# EAGLE schematic soundpuddle_megawing_mk1 (EAGLE 6.2)
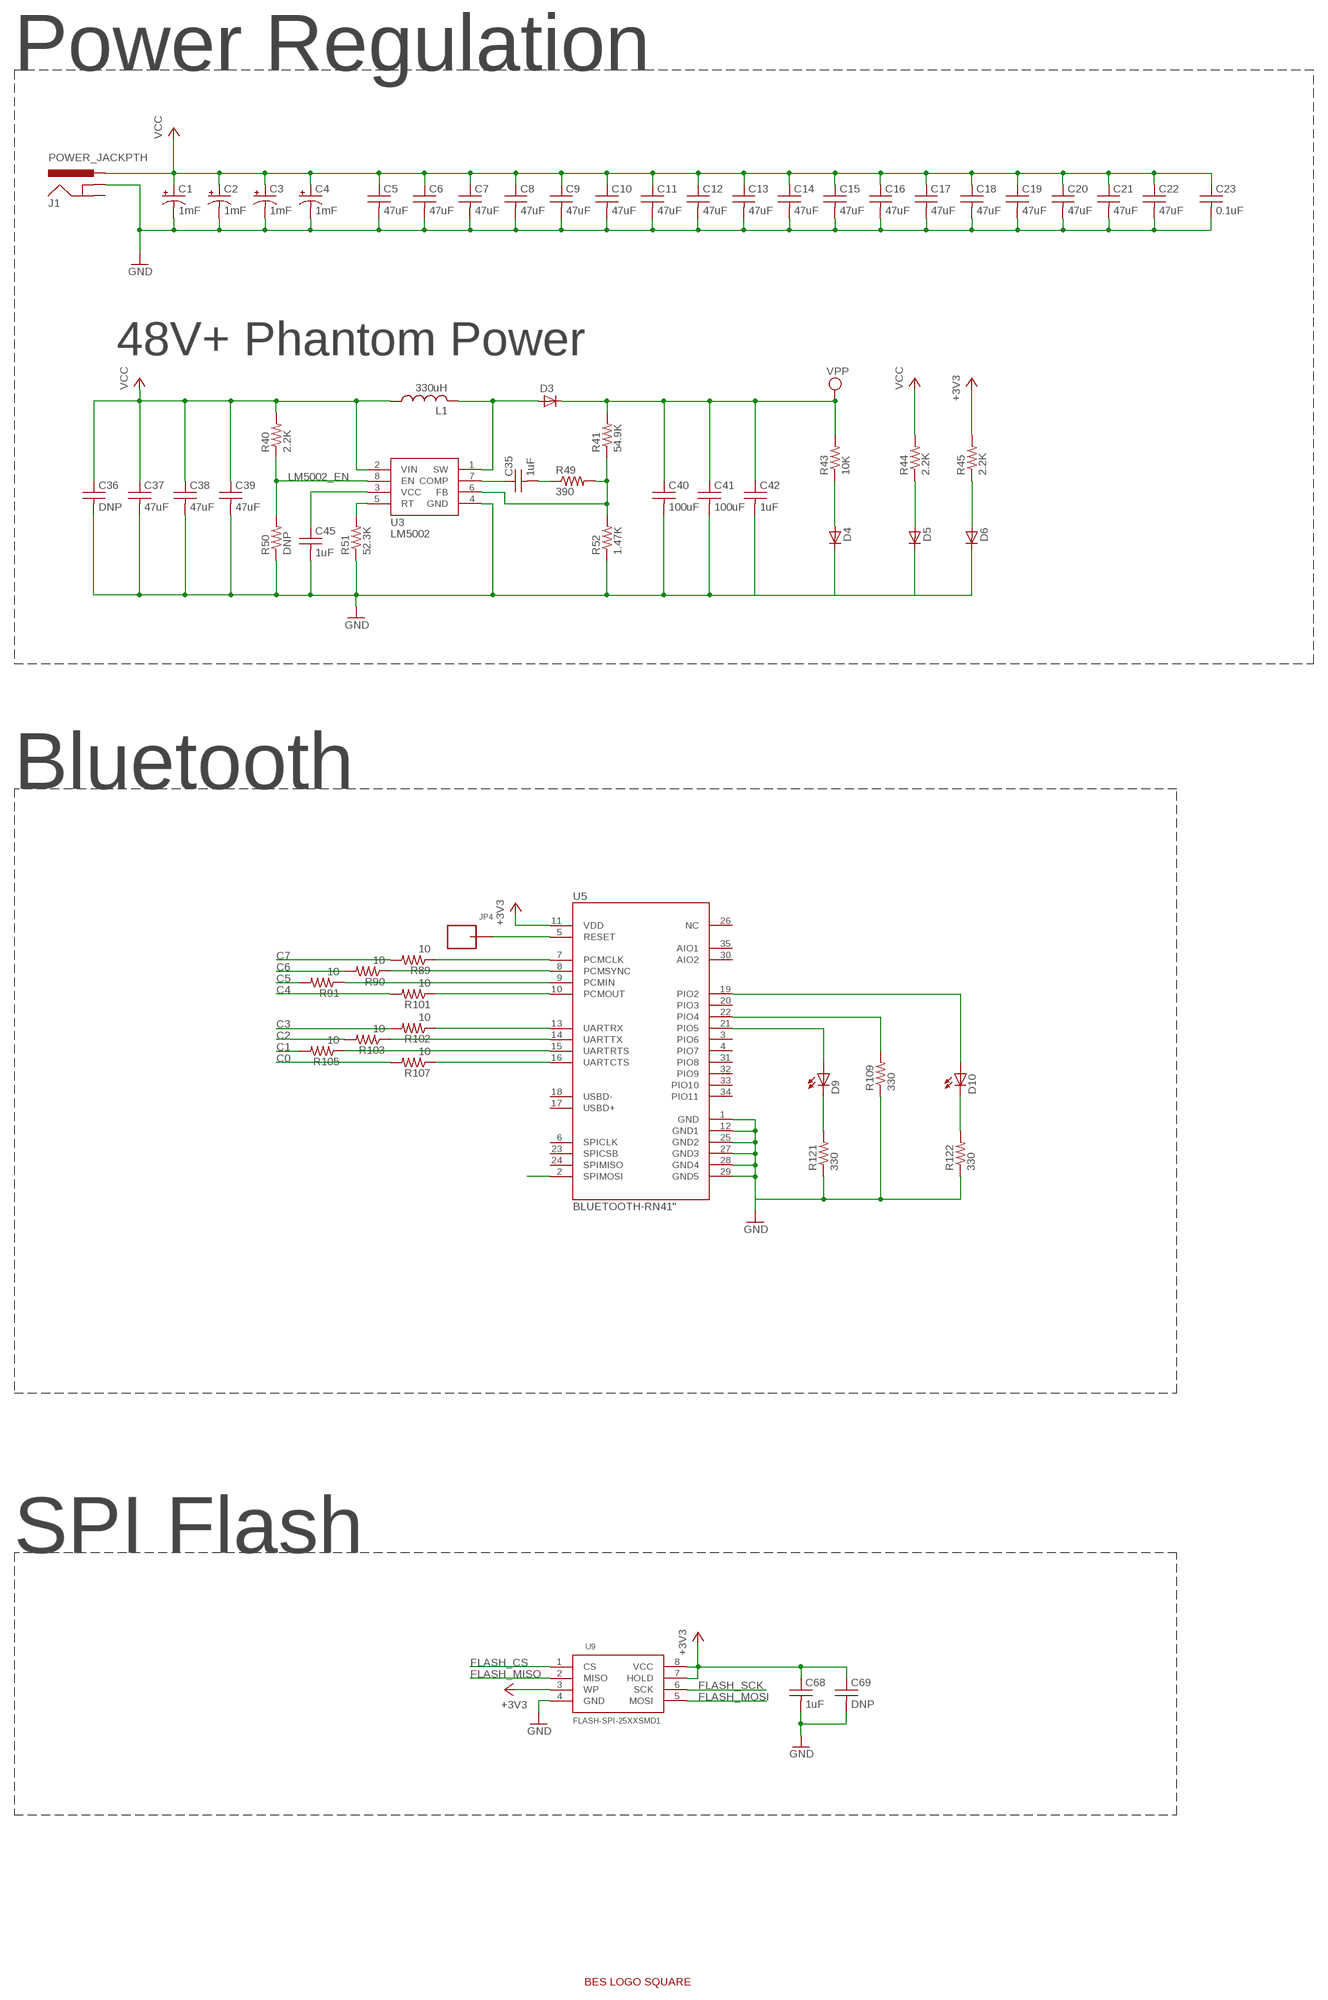
[diagram p0: schematic, sheet 1, part 1 of 3]
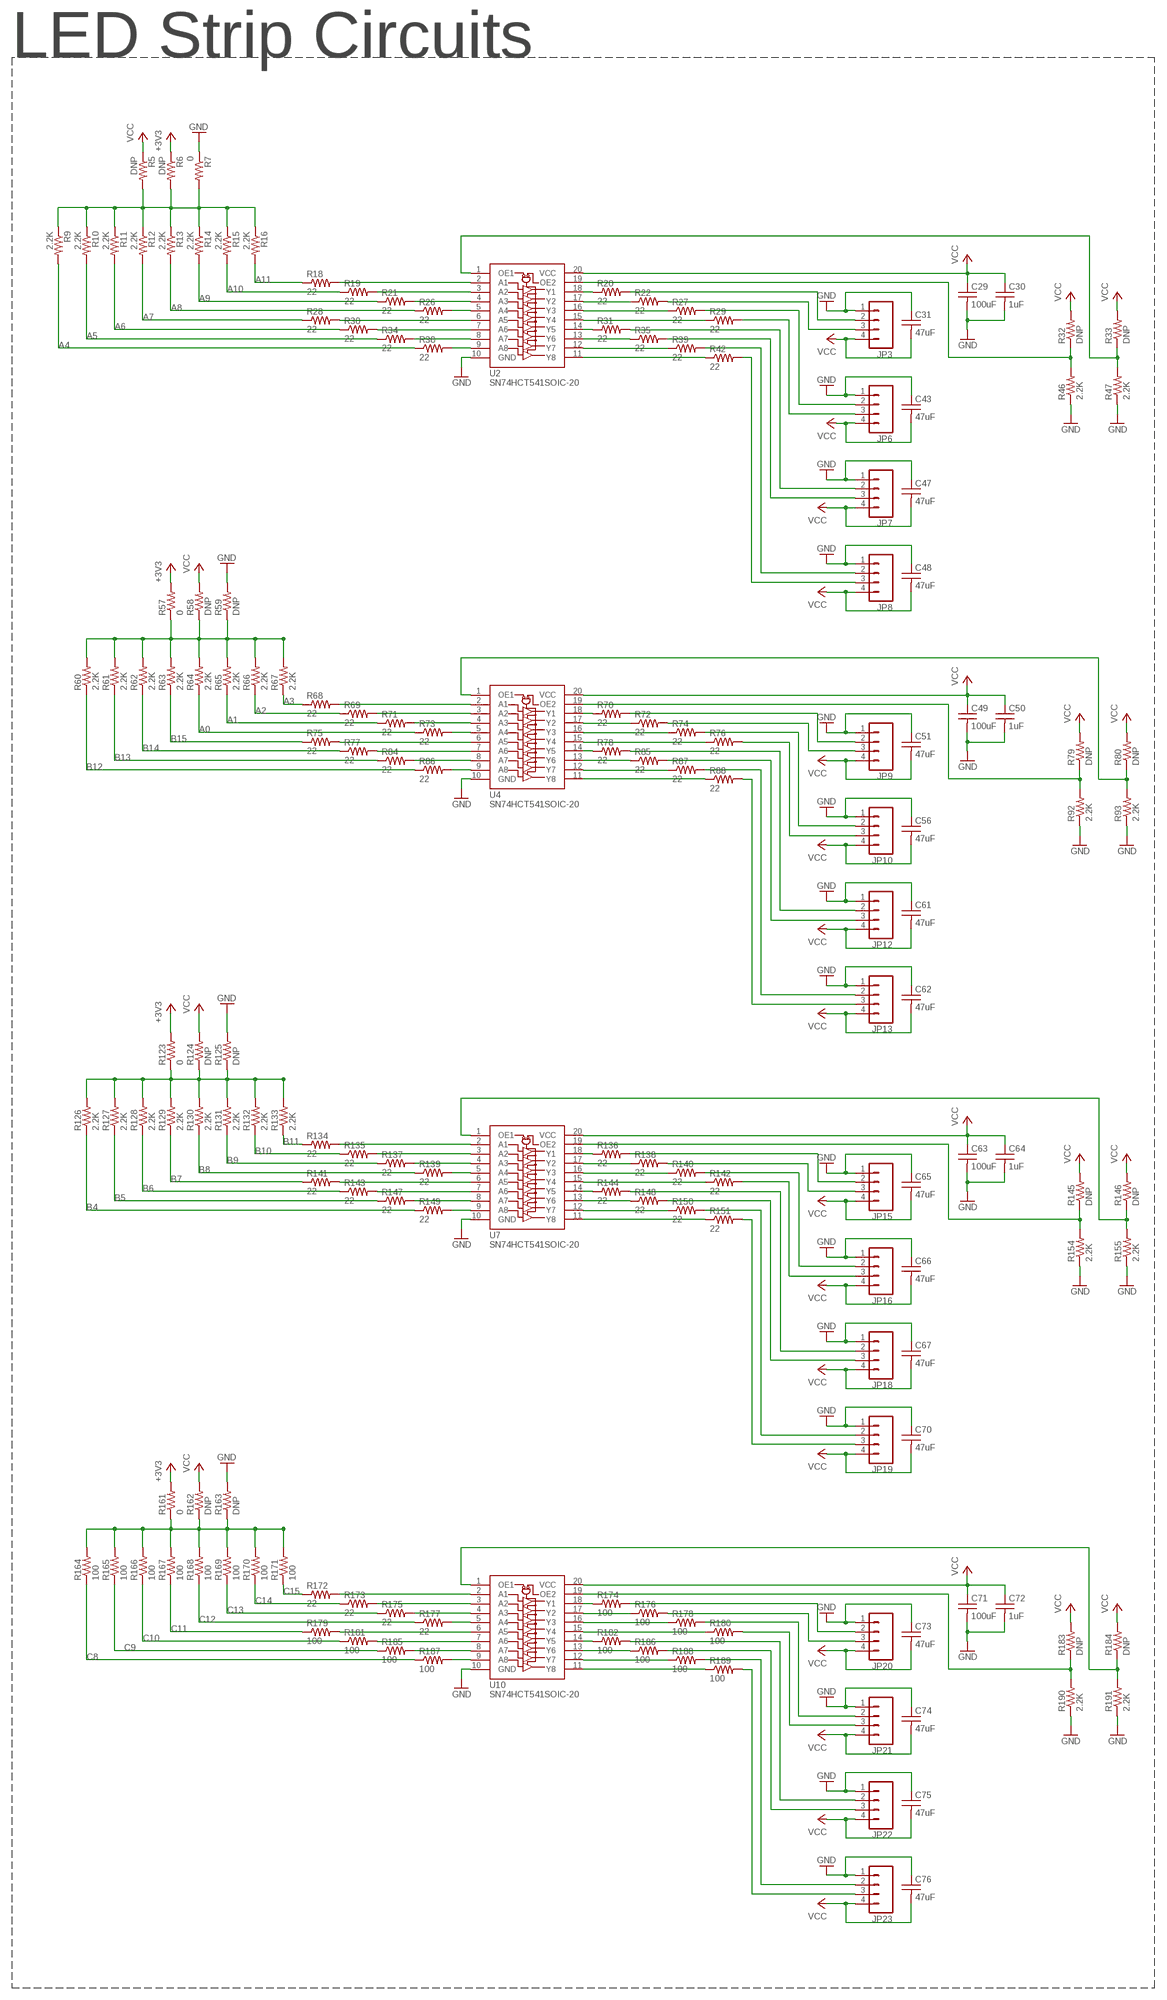
[diagram p1: schematic, sheet 1, part 2 of 3]
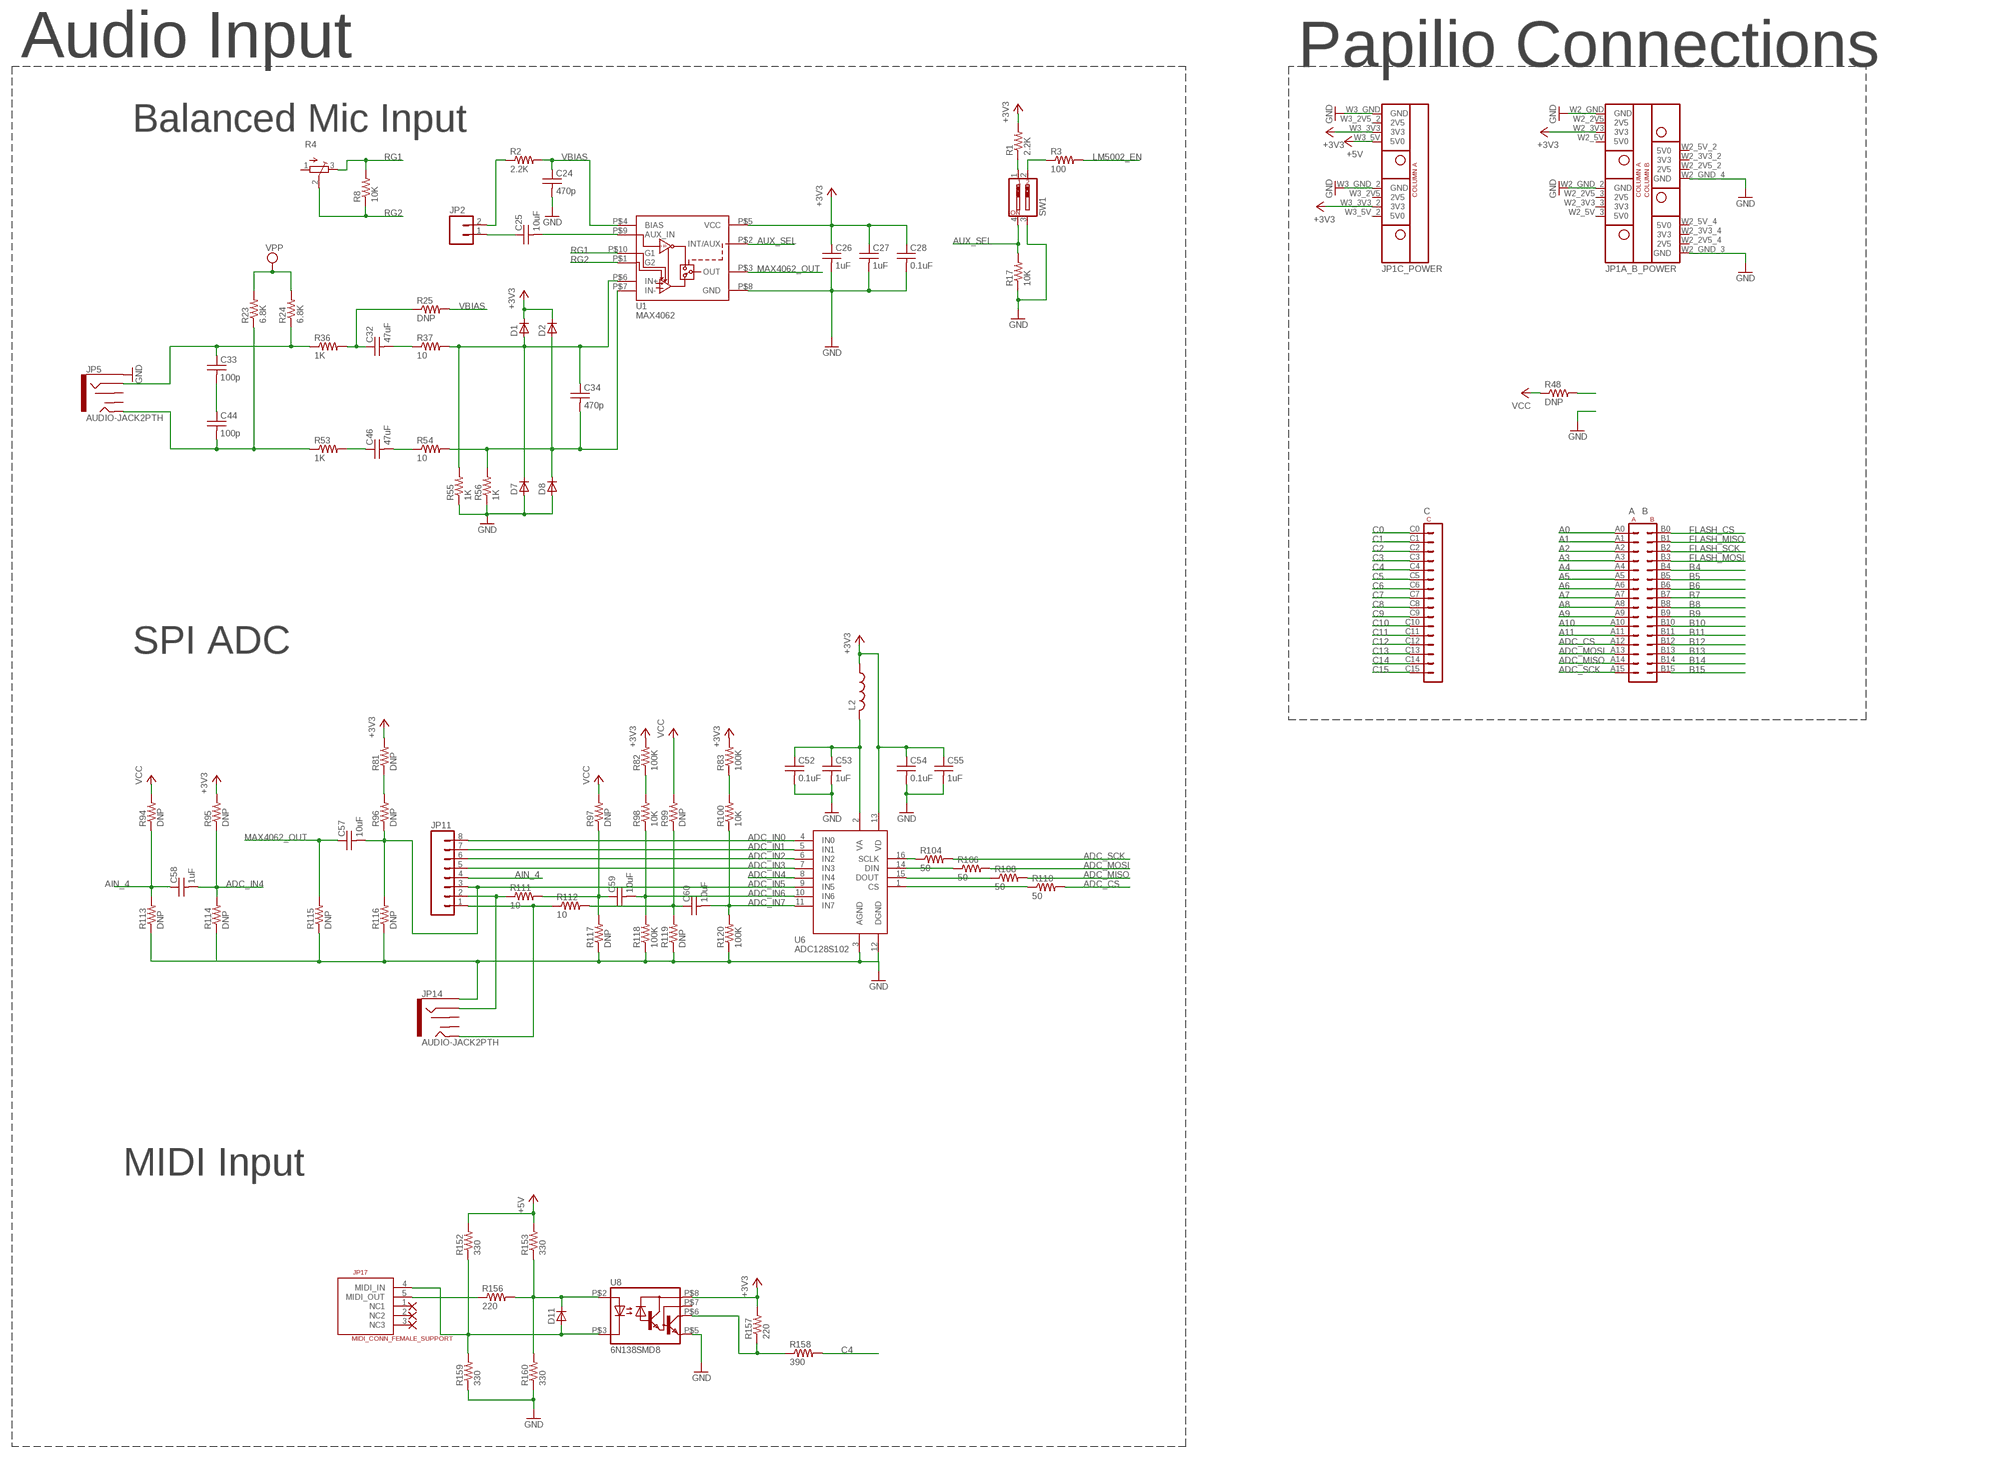
[diagram p2: schematic, sheet 1, part 3 of 3]

## Parts
C1  1mF  CPOL-USE5-8.5  [E5-8,5]
C2  1mF  CPOL-USE5-8.5  [E5-8,5]
C3  1mF  CPOL-USE5-8.5  [E5-8,5]
C4  1mF  CPOL-USE5-8.5  [E5-8,5]
C5  47uF  CAPACITORC_1206  [1206]
C6  47uF  CAPACITORC_1206  [1206]
C7  47uF  CAPACITORC_1206  [1206]
C8  47uF  CAPACITORC_1206  [1206]
C9  47uF  CAPACITORC_1206  [1206]
C10  47uF  CAPACITORC_1206  [1206]
C11  47uF  CAPACITORC_1206  [1206]
C12  47uF  CAPACITORC_1206  [1206]
C13  47uF  CAPACITORC_1206  [1206]
C14  47uF  CAPACITORC_1206  [1206]
C15  47uF  CAPACITORC_1206  [1206]
C16  47uF  CAPACITORC_1206  [1206]
C17  47uF  CAPACITORC_1206  [1206]
C18  47uF  CAPACITORC_1206  [1206]
C19  47uF  CAPACITORC_1206  [1206]
C20  47uF  CAPACITORC_1206  [1206]
C21  47uF  CAPACITORC_1206  [1206]
C22  47uF  CAPACITORC_1206  [1206]
C23  0.1uF  CAPACITORC_0603  [0603]
C24  470p  CAPACITORC_0603  [0603]
C25  10uF  CAPACITORC_0603  [0603]
C26  1uF  CAPACITORC_0603  [0603]
C27  1uF  CAPACITORC_0603  [0603]
C28  0.1uF  CAPACITORC_0603  [0603]
C29  100uF  CAPACITORC_1206  [1206]
C30  1uF  CAPACITORC_0603  [0603]
C31  47uF  CAPACITORC_1206  [1206]
C32  47uF  CAPACITORC_1206  [1206]
C33  100p  CAPACITORC_0603  [0603]
C34  470p  CAPACITORC_0603  [0603]
C35  1uF  CAPACITORC_0603  [0603]
C36  DNP  CAPACITORC_0603  [0603]
C37  47uF  CAPACITORC_1206  [1206]
C38  47uF  CAPACITORC_1206  [1206]
C39  47uF  CAPACITORC_1206  [1206]
C40  100uF  CAPACITORC_1206  [1206]
C41  100uF  CAPACITORC_1206  [1206]
C42  1uF  CAPACITORC_0603  [0603]
C43  47uF  CAPACITORC_1206  [1206]
C44  100p  CAPACITORC_0603  [0603]
C45  1uF  CAPACITORC_0603  [0603]
C46  47uF  CAPACITORC_1206  [1206]
C47  47uF  CAPACITORC_1206  [1206]
C48  47uF  CAPACITORC_1206  [1206]
C49  100uF  CAPACITORC_1206  [1206]
C50  1uF  CAPACITORC_0603  [0603]
C51  47uF  CAPACITORC_1206  [1206]
C52  0.1uF  CAPACITORC_0603  [0603]
C53  1uF  CAPACITORC_0603  [0603]
C54  0.1uF  CAPACITORC_0603  [0603]
C55  1uF  CAPACITORC_0603  [0603]
C56  47uF  CAPACITORC_1206  [1206]
C57  10uF  CAPACITORC_0603  [0603]
C58  1uF  CAPACITORC_0603  [0603]
C59  10uF  CAPACITORC_0603  [0603]
C60  10uF  CAPACITORC_0603  [0603]
C61  47uF  CAPACITORC_1206  [1206]
C62  47uF  CAPACITORC_1206  [1206]
C63  100uF  CAPACITORC_1206  [1206]
C64  1uF  CAPACITORC_0603  [0603]
C65  47uF  CAPACITORC_1206  [1206]
C66  47uF  CAPACITORC_1206  [1206]
C67  47uF  CAPACITORC_1206  [1206]
C68  1uF  CAPACITORC_0603  [0603]
C69  DNP  CAPACITORC_1206  [1206]
C70  47uF  CAPACITORC_1206  [1206]
C71  100uF  CAPACITORC_1206  [1206]
C72  1uF  CAPACITORC_0603  [0603]
C73  47uF  CAPACITORC_1206  [1206]
C74  47uF  CAPACITORC_1206  [1206]
C75  47uF  CAPACITORC_1206  [1206]
C76  47uF  CAPACITORC_1206  [1206]
D1  DIODE_SMDSOD-323  [SOD-323]
D2  DIODE_SMDSOD-323  [SOD-323]
D3  DIODE_SMDSOD-323  [SOD-323]
D4  DIODE_SMDSOD-323  [SOD-323]
D5  DIODE_SMDSOD-323  [SOD-323]
D6  DIODE_SMDSOD-323  [SOD-323]
D7  DIODE_SMDSOD-323  [SOD-323]
D8  DIODE_SMDSOD-323  [SOD-323]
D9  LED0805  [LED_0805]
D10  LED0805  [LED_0805]
D11  DIODE_SMDSOD-323  [SOD-323]
J1  POWER_JACKPTH  [POWER_JACK_PTH]
JP1  PAPILIO_PLUS_MEGAWING  [PAPILIO_PLUS]
JP2  M02PTH  [1X02]
JP3  M04POLAR  [MOLEX-1X4]
JP4  HEADER-SMALL-1PIN  [HEADER-SMALL-1PIN-0.036IN]
JP5  AUDIO-JACK2PTH  [AUDIO-JACK]
JP6  M04POLAR  [MOLEX-1X4]
JP7  M04POLAR  [MOLEX-1X4]
JP8  M04POLAR  [MOLEX-1X4]
JP9  M04POLAR  [MOLEX-1X4]
JP10  M04POLAR  [MOLEX-1X4]
JP11  M081X08  [1X08]
JP12  M04POLAR  [MOLEX-1X4]
JP13  M04POLAR  [MOLEX-1X4]
JP14  AUDIO-JACK2PTH  [AUDIO-JACK]
JP15  M04POLAR  [MOLEX-1X4]
JP16  M04POLAR  [MOLEX-1X4]
JP17  MIDI_CONN_FEMALE_SUPPORT  [DIN_5_FEMALE_SUPPORT]
JP18  M04POLAR  [MOLEX-1X4]
JP19  M04POLAR  [MOLEX-1X4]
JP20  M04POLAR  [MOLEX-1X4]
JP21  M04POLAR  [MOLEX-1X4]
JP22  M04POLAR  [MOLEX-1X4]
JP23  M04POLAR  [MOLEX-1X4]
L1  330uH  INDUCTOR10X10MM  [INDUCTOR_10X10MM]
L2  INDUCTOR0603  [0603]
LOGO1  LOGO  [LOGO]
R1  2.2K  RESISTORR_0603  [0603]
R2  2.2K  RESISTORR_0603  [0603]
R3  100  RESISTORR_0603  [0603]
R4  TRIMPOTTC33X  [TC33X]
R5  DNP  RESISTORR_0603  [0603]
R6  DNP  RESISTORR_0603  [0603]
R7  0  RESISTORR_0603  [0603]
R8  10K  RESISTORR_0603  [0603]
R9  2.2K  RESISTORR_0603  [0603]
R10  2.2K  RESISTORR_0603  [0603]
R11  2.2K  RESISTORR_0603  [0603]
R12  2.2K  RESISTORR_0603  [0603]
R13  2.2K  RESISTORR_0603  [0603]
R14  2.2K  RESISTORR_0603  [0603]
R15  2.2K  RESISTORR_0603  [0603]
R16  2.2K  RESISTORR_0603  [0603]
R17  10K  RESISTORR_0603  [0603]
R18  22  RESISTORR_0603  [0603]
R19  22  RESISTORR_0603  [0603]
R20  22  RESISTORR_0603  [0603]
R21  22  RESISTORR_0603  [0603]
R22  22  RESISTORR_0603  [0603]
R23  6.8K  RESISTORR_0603  [0603]
R24  6.8K  RESISTORR_0603  [0603]
R25  DNP  RESISTORR_0603  [0603]
R26  22  RESISTORR_0603  [0603]
R27  22  RESISTORR_0603  [0603]
R28  22  RESISTORR_0603  [0603]
R29  22  RESISTORR_0603  [0603]
R30  22  RESISTORR_0603  [0603]
R31  22  RESISTORR_0603  [0603]
R32  DNP  RESISTORR_0603  [0603]
R33  DNP  RESISTORR_0603  [0603]
R34  22  RESISTORR_0603  [0603]
R35  22  RESISTORR_0603  [0603]
R36  1K  RESISTORR_0603  [0603]
R37  10  RESISTORR_0603  [0603]
R38  22  RESISTORR_0603  [0603]
R39  22  RESISTORR_0603  [0603]
R40  2.2K  RESISTORR_0603  [0603]
R41  54.9K  RESISTORR_0603  [0603]
R42  22  RESISTORR_0603  [0603]
R43  10K  RESISTORR_0603  [0603]
R44  2.2K  RESISTORR_0603  [0603]
R45  2.2K  RESISTORR_0603  [0603]
R46  2.2K  RESISTORR_0603  [0603]
R47  2.2K  RESISTORR_0603  [0603]
R48  DNP  RESISTORR_0603  [0603]
R49  390  RESISTORR_0603  [0603]
R50  DNP  RESISTORR_0603  [0603]
R51  52.3K  RESISTORR_0603  [0603]
R52  1.47K  RESISTORR_0603  [0603]
R53  1K  RESISTORR_0603  [0603]
R54  10  RESISTORR_0603  [0603]
R55  1K  RESISTORR_0603  [0603]
R56  1K  RESISTORR_0603  [0603]
R57  0  RESISTORR_0603  [0603]
R58  DNP  RESISTORR_0603  [0603]
R59  DNP  RESISTORR_0603  [0603]
R60  2.2K  RESISTORR_0603  [0603]
R61  2.2K  RESISTORR_0603  [0603]
R62  2.2K  RESISTORR_0603  [0603]
R63  2.2K  RESISTORR_0603  [0603]
R64  2.2K  RESISTORR_0603  [0603]
R65  2.2K  RESISTORR_0603  [0603]
R66  2.2K  RESISTORR_0603  [0603]
R67  2.2K  RESISTORR_0603  [0603]
R68  22  RESISTORR_0603  [0603]
R69  22  RESISTORR_0603  [0603]
R70  22  RESISTORR_0603  [0603]
R71  22  RESISTORR_0603  [0603]
R72  22  RESISTORR_0603  [0603]
R73  22  RESISTORR_0603  [0603]
R74  22  RESISTORR_0603  [0603]
R75  22  RESISTORR_0603  [0603]
R76  22  RESISTORR_0603  [0603]
R77  22  RESISTORR_0603  [0603]
R78  22  RESISTORR_0603  [0603]
R79  DNP  RESISTORR_0603  [0603]
R80  DNP  RESISTORR_0603  [0603]
R81  DNP  RESISTORR_0603  [0603]
R82  100K  RESISTORR_0603  [0603]
R83  100K  RESISTORR_0603  [0603]
R84  22  RESISTORR_0603  [0603]
R85  22  RESISTORR_0603  [0603]
R86  22  RESISTORR_0603  [0603]
R87  22  RESISTORR_0603  [0603]
R88  22  RESISTORR_0603  [0603]
R89  10  RESISTORR_0603  [0603]
R90  10  RESISTORR_0603  [0603]
R91  10  RESISTORR_0603  [0603]
R92  2.2K  RESISTORR_0603  [0603]
R93  2.2K  RESISTORR_0603  [0603]
R94  DNP  RESISTORR_0603  [0603]
R95  DNP  RESISTORR_0603  [0603]
R96  DNP  RESISTORR_0603  [0603]
R97  DNP  RESISTORR_0603  [0603]
R98  10K  RESISTORR_0603  [0603]
R99  DNP  RESISTORR_0603  [0603]
R100  10K  RESISTORR_0603  [0603]
R101  10  RESISTORR_0603  [0603]
R102  10  RESISTORR_0603  [0603]
R103  10  RESISTORR_0603  [0603]
R104  50  RESISTORR_0603  [0603]
R105  10  RESISTORR_0603  [0603]
R106  50  RESISTORR_0603  [0603]
R107  10  RESISTORR_0603  [0603]
R108  50  RESISTORR_0603  [0603]
R109  330  RESISTORR_0603  [0603]
R110  50  RESISTORR_0603  [0603]
R111  10  RESISTORR_0603  [0603]
R112  10  RESISTORR_0603  [0603]
R113  DNP  RESISTORR_0603  [0603]
R114  DNP  RESISTORR_0603  [0603]
R115  DNP  RESISTORR_0603  [0603]
R116  DNP  RESISTORR_0603  [0603]
R117  DNP  RESISTORR_0603  [0603]
R118  100K  RESISTORR_0603  [0603]
R119  DNP  RESISTORR_0603  [0603]
R120  100K  RESISTORR_0603  [0603]
R121  330  RESISTORR_0603  [0603]
R122  330  RESISTORR_0603  [0603]
R123  0  RESISTORR_0603  [0603]
R124  DNP  RESISTORR_0603  [0603]
R125  DNP  RESISTORR_0603  [0603]
R126  2.2K  RESISTORR_0603  [0603]
R127  2.2K  RESISTORR_0603  [0603]
R128  2.2K  RESISTORR_0603  [0603]
R129  2.2K  RESISTORR_0603  [0603]
R130  2.2K  RESISTORR_0603  [0603]
R131  2.2K  RESISTORR_0603  [0603]
R132  2.2K  RESISTORR_0603  [0603]
R133  2.2K  RESISTORR_0603  [0603]
R134  22  RESISTORR_0603  [0603]
R135  22  RESISTORR_0603  [0603]
R136  22  RESISTORR_0603  [0603]
R137  22  RESISTORR_0603  [0603]
R138  22  RESISTORR_0603  [0603]
R139  22  RESISTORR_0603  [0603]
R140  22  RESISTORR_0603  [0603]
R141  22  RESISTORR_0603  [0603]
R142  22  RESISTORR_0603  [0603]
R143  22  RESISTORR_0603  [0603]
R144  22  RESISTORR_0603  [0603]
R145  DNP  RESISTORR_0603  [0603]
R146  DNP  RESISTORR_0603  [0603]
R147  22  RESISTORR_0603  [0603]
R148  22  RESISTORR_0603  [0603]
R149  22  RESISTORR_0603  [0603]
R150  22  RESISTORR_0603  [0603]
R151  22  RESISTORR_0603  [0603]
R152  330  RESISTORR_0603  [0603]
R153  330  RESISTORR_0603  [0603]
R154  2.2K  RESISTORR_0603  [0603]
R155  2.2K  RESISTORR_0603  [0603]
R156  220  RESISTORR_0603  [0603]
R157  220  RESISTORR_0603  [0603]
R158  390  RESISTORR_0603  [0603]
R159  330  RESISTORR_0603  [0603]
R160  330  RESISTORR_0603  [0603]
R161  0  RESISTORR_0603  [0603]
R162  DNP  RESISTORR_0603  [0603]
R163  DNP  RESISTORR_0603  [0603]
R164  100  RESISTORR_0603  [0603]
R165  100  RESISTORR_0603  [0603]
R166  100  RESISTORR_0603  [0603]
R167  100  RESISTORR_0603  [0603]
R168  100  RESISTORR_0603  [0603]
R169  100  RESISTORR_0603  [0603]
R170  100  RESISTORR_0603  [0603]
R171  100  RESISTORR_0603  [0603]
R172  22  RESISTORR_0603  [0603]
R173  22  RESISTORR_0603  [0603]
R174  100  RESISTORR_0603  [0603]
R175  22  RESISTORR_0603  [0603]
R176  100  RESISTORR_0603  [0603]
R177  22  RESISTORR_0603  [0603]
R178  100  RESISTORR_0603  [0603]
R179  100  RESISTORR_0603  [0603]
R180  100  RESISTORR_0603  [0603]
R181  100  RESISTORR_0603  [0603]
R182  100  RESISTORR_0603  [0603]
R183  DNP  RESISTORR_0603  [0603]
R184  DNP  RESISTORR_0603  [0603]
R185  100  RESISTORR_0603  [0603]
R186  100  RESISTORR_0603  [0603]
R187  100  RESISTORR_0603  [0603]
R188  100  RESISTORR_0603  [0603]
R189  100  RESISTORR_0603  [0603]
R190  2.2K  RESISTORR_0603  [0603]
R191  2.2K  RESISTORR_0603  [0603]
SW1  SW_DIP-2  [DIPSWITCH-02]
U1  MAX4062  [MSOP10]
U2  SN74HCT541SOIC-20  [SOIC-20]
U3  LM5002  [SO8]
U4  SN74HCT541SOIC-20  [SOIC-20]
U5  BLUETOOTH-RN41"  [RN41]
U6  ADC128S102  [TSSOP16]
U7  SN74HCT541SOIC-20  [SOIC-20]
U8  6N138SMD8  [SMD-8]
U9  FLASH-SPI-25XXSMD1  [SO08-EIAJ]
U10  SN74HCT541SOIC-20  [SOIC-20]

## Nets
+3V3: C26.1 C27.1 C28.1 C54.1 C55.1 C68.1 C69.P$1 D1.C D2.C JP1.W2_3V3(A_B_POWER:3V3) JP1.W3_3V3(C_POWER:3V3) JP1.W3_3V3_2(C_POWER:3V3) L2.1 R1.2 R6.1 R45.2 R57.2 R81.2 R82.2 R83.2 R95.2 R123.2 R157.2 R161.2 U1.P$5(VCC) U5.11(VDD) U6.13(VD) U8.P$8(VCC) U9.3(WP) U9.7(HOLD) U9.8(VCC)
+5V: JP1.W3_5V(C_POWER:5V0) R152.2 R153.2
A0: JP1.A0 R64.1 R73.1
A1: JP1.A1 R65.1 R71.1
A2: JP1.A2 R66.1 R69.1
A3: JP1.A3 R67.1 R68.1
A4: JP1.A4 R9.2 R38.1
A5: JP1.A5 R10.2 R34.1
A6: JP1.A6 R11.2 R30.1
A7: JP1.A7 R12.2 R28.1
A8: JP1.A8 R13.2 R26.1
A9: JP1.A9 R14.2 R21.1
A10: JP1.A10 R15.2 R19.1
A11: JP1.A11 R16.2 R18.1
ADC_CS: JP1.A12 R110.2
ADC_IN0: JP11.8 U6.4(IN0)
ADC_IN1: JP11.7 U6.5(IN1)
ADC_IN2: JP11.6 U6.6(IN2)
ADC_IN3: JP11.5 U6.7(IN3)
ADC_IN4: C58.2 R95.1 R114.2 U6.8(IN4)
ADC_IN5: C57.2 JP11.3 R96.1 R116.2 U6.9(IN5)
ADC_IN6: C59.2 R98.1 R118.2 U6.10(IN6)
ADC_IN7: C60.2 R100.1 R120.2 U6.11(IN7)
ADC_MISO: JP1.A14 R108.2
ADC_MOSI: JP1.A13 R106.2
ADC_SCK: JP1.A15 R104.2
AIN_4: C58.1 JP11.4 R94.1 R113.2
AUX_SEL: R17.2 SW1.4 U1.P$2(INT/AUX)
B4: JP1.B4 R126.1 R149.1
B5: JP1.B5 R127.1 R147.1
B6: JP1.B6 R128.1 R143.1
B7: JP1.B7 R129.1 R141.1
B8: JP1.B8 R130.1 R139.1
B9: JP1.B9 R131.1 R137.1
B10: JP1.B10 R132.1 R135.1
B11: JP1.B11 R133.1 R134.1
B12: JP1.B12 R60.1 R86.1
B13: JP1.B13 R61.1 R84.1
B14: JP1.B14 R62.1 R77.1
B15: JP1.B15 R63.1 R75.1
C0: JP1.C0 R107.2
C1: JP1.C1 R105.2
C2: JP1.C2 R103.2
C3: JP1.C3 R102.2
C4: JP1.C4 R101.2 R158.2
C5: JP1.C5 R91.2
C6: JP1.C6 R90.2
C7: JP1.C7 R89.2
C8: JP1.C8 R164.1 R187.1
C9: JP1.C9 R165.1 R185.1
C10: JP1.C10 R166.1 R181.1
C11: JP1.C11 R167.1 R179.1
C12: JP1.C12 R168.1 R177.1
C13: JP1.C13 R169.1 R175.1
C14: JP1.C14 R170.1 R173.1
C15: JP1.C15 R171.1 R172.1
FLASH_CS: JP1.B0 U9.1(CS)
FLASH_MISO: JP1.B1 U9.2(MISO)
FLASH_MOSI: JP1.B3 U9.5(MOSI)
FLASH_SCK: JP1.B2 U9.6(SCK)
GND: C1.- C2.- C3.- C4.- C5.P$2 C6.P$2 C7.P$2 C8.P$2 C9.P$2 C10.P$2 C11.P$2 C12.P$2 C13.P$2 C14.P$2 C15.P$2 C16.P$2 C17.P$2 C18.P$2 C19.P$2 C20.P$2 C21.P$2 C22.P$2 C23.2 C24.2 C26.2 C27.2 C28.2 C29.P$2 C30.2 C31.P$1 C36.2 C37.P$2 C38.P$2 C39.P$2 C40.P$2 C41.P$2 C42.2 C43.P$1 C45.2 C47.P$1 C48.P$1 C49.P$2 C50.2 C51.P$1 C52.2 C53.2 C54.2 C55.2 C56.P$1 C61.P$1 C62.P$1 C63.P$2 C64.2 C65.P$1 C66.P$1 C67.P$1 C68.2 C69.P$2 C70.P$1 C71.P$2 C72.2 C73.P$1 C74.P$1 C75.P$1 C76.P$1 D4.C D5.C D6.C D7.A D8.A J1.GNDBREAK JP1.W2_GND(A_B_POWER:GND) JP1.W2_GND_2(A_B_POWER:GND) JP1.W2_GND_3(A_B_POWER:GND) JP1.W2_GND_4(A_B_POWER:GND) JP1.W3_GND(C_POWER:GND) JP1.W3_GND_2(C_POWER:GND) JP3.1 JP5.SLEEVE JP6.1 JP7.1 JP8.1 JP9.1 JP10.1 JP12.1 JP13.1 JP14.SLEEVE JP15.1 JP16.1 JP18.1 JP19.1 JP20.1 JP21.1 JP22.1 JP23.1 R7.1 R17.1 R46.1 R47.1 R50.1 R51.1 R52.1 R55.1 R56.1 R59.2 R92.1 R93.1 R109.1 R113.1 R114.1 R115.1 R116.1 R117.1 R118.1 R119.1 R120.1 R121.1 R122.1 R125.2 R154.1 R155.1 R159.1 R160.1 R163.2 R190.1 R191.1 SW1.3 U1.P$8(GND) U2.10(GND) U3.4(GND) U4.10(GND) U5.1(GND) U5.12(GND1) U5.25(GND2) U5.27(GND3) U5.28(GND4) U5.29(GND5) U6.3(AGND) U6.12(DGND) U7.10(GND) U8.P$5(GND) U9.4(GND) U10.10(GND)
LM5002_EN: R3.2 R40.1 R50.2 U3.8(EN)
MAX4062_OUT: C57.1 R115.2 U1.P$3(OUT)
N$1: C52.1 C53.1 L2.2 U6.2(VA)
N$2: R107.1 U5.16(UARTCTS)
N$3: JP2.2 R2.1
N$4: C25.1 JP2.1
N$5: R105.1 U5.15(UARTRTS)
N$6: R103.1 U5.14(UARTTX)
N$7: C46.P$1 R53.2
N$8: C44.2 JP5.TIP R23.1 R53.1
N$9: C33.2 C44.1
N$10: C32.P$1 R25.1 R36.2
N$11: R102.1 U5.13(UARTRX)
N$12: R104.1 U6.16(SCLK)
N$13: R106.1 U6.14(DIN)
N$14: R110.1 U6.1(CS)
N$15: R108.1 U6.15(DOUT)
N$16: D9.2(C) R121.2
N$17: D10.2(C) R122.2
N$18: D10.1(A) U5.19(PIO2)
N$19: D9.1(A) U5.21(PIO5)
N$20: D3.A L1.P$2 U3.1(SW)
N$21: R109.2 U5.22(PIO4)
N$22: JP20.3 R176.2
N$23: R1.1 SW1.1
N$24: R33.1 R47.2 U2.1(OE1)
N$25: R48.2
N$26: R5.2 R6.2 R7.2 R9.1 R10.1 R11.1 R12.1 R13.1 R14.1 R15.1 R16.1
N$27: C32.P$2 R37.1
N$28: C46.P$2 R54.1
N$29: D4.A R43.1
N$30: D5.A R44.1
N$31: R81.1 R96.2
N$32: R82.1 R98.2
N$33: JP11.2 JP14.RING R111.1
N$34: R83.1 R100.2
N$35: JP11.1 JP14.TIP R112.1
N$36: C60.1 R99.1 R112.2 R119.2
N$37: C59.1 R97.1 R111.2 R117.2
N$38: R3.1 SW1.2
N$40: R161.1 R162.1 R163.1 R164.2 R165.2 R166.2 R167.2 R168.2 R169.2 R170.2 R171.2
N$41: R101.1 U5.10(PCMOUT)
N$42: D6.A R45.1
N$43: R79.1 R92.2 U4.19(OE2)
N$44: R145.1 R154.2 U7.19(OE2)
N$45: R184.1 R191.2 U10.1(OE1)
N$46: R91.1 U5.9(PCMIN)
N$47: R90.1 U5.8(PCMSYNC)
N$48: R89.1 U5.7(PCMCLK)
N$49: R183.1 R190.2 U10.19(OE2)
N$50: JP4.P$1 U5.5(RESET)
N$51: U5.2(SPIMOSI)
N$53: JP17.5(MIDI_OUT) R156.1
N$54: D11.C R153.1 R156.2 R160.2 U8.P$2(A)
N$55: D11.A JP17.4(MIDI_IN) R152.1 R159.2 U8.P$3(C)
N$56: R32.1 R46.2 U2.19(OE2)
N$57: R19.2 U2.3(A2)
N$58: R26.2 U2.5(A4)
N$59: R18.2 U2.2(A1)
N$60: R157.1 R158.1 U8.P$6(VO)
N$64: R21.2 U2.4(A3)
N$68: R28.2 U2.6(A5)
N$72: R30.2 U2.7(A6)
N$73: R34.2 U2.8(A7)
N$74: R38.2 U2.9(A8)
N$76: R31.1 U2.14(Y5)
N$77: R20.1 U2.18(Y1)
N$78: R22.1 U2.17(Y2)
N$79: R27.1 U2.16(Y3)
N$80: R29.1 U2.15(Y4)
N$81: R35.1 U2.13(Y6)
N$82: R39.1 U2.12(Y7)
N$83: R42.1 U2.11(Y8)
N$84: JP7.2 R31.2
N$85: JP7.3 R35.2
N$86: JP8.2 R39.2
N$87: JP8.3 R42.2
N$88: JP6.3 R29.2
N$89: JP6.2 R27.2
N$90: JP3.3 R22.2
N$91: JP3.2 R20.2
N$94: JP13.2 R87.2
N$95: R51.2 U3.5(RT)
N$96: C45.1 U3.3(VCC)
N$97: C35.1 U3.7(COMP)
N$98: R41.1 R49.2 R52.2 U3.6(FB)
N$100: C35.2 R49.1
N$101: C34.2 D2.A D8.C R54.2 R56.2 U1.P$7(IN-)
N$102: C25.2 U1.P$9(AUX_IN)
N$104: R80.1 R93.2 U4.1(OE1)
N$105: C33.1 JP5.RING R24.1 R36.1
N$115: C34.1 D1.A D7.C R37.2 R55.2 U1.P$6(IN+)
N$116: R68.2 U4.2(A1)
N$118: R69.2 U4.3(A2)
N$119: R73.2 U4.5(A4)
N$120: R71.2 U4.4(A3)
N$124: R75.2 U4.6(A5)
N$127: R77.2 U4.7(A6)
N$128: R84.2 U4.8(A7)
N$129: R86.2 U4.9(A8)
N$132: R57.1 R58.1 R59.1 R60.2 R61.2 R62.2 R63.2 R64.2 R65.2 R66.2 R67.2
N$133: R78.1 U4.14(Y5)
N$134: R70.1 U4.18(Y1)
N$135: R72.1 U4.17(Y2)
N$136: R74.1 U4.16(Y3)
N$137: R76.1 U4.15(Y4)
N$138: R85.1 U4.13(Y6)
N$139: R87.1 U4.12(Y7)
N$140: R88.1 U4.11(Y8)
N$141: JP12.2 R78.2
N$142: JP12.3 R85.2
N$143: JP13.3 R88.2
N$144: JP23.2 R188.2
N$145: JP10.3 R76.2
N$146: JP10.2 R74.2
N$147: JP9.3 R72.2
N$148: JP9.2 R70.2
N$149: R146.1 R155.2 U7.1(OE1)
N$150: R134.2 U7.2(A1)
N$152: R135.2 U7.3(A2)
N$153: R139.2 U7.5(A4)
N$154: R137.2 U7.4(A3)
N$158: R141.2 U7.6(A5)
N$161: R143.2 U7.7(A6)
N$162: R147.2 U7.8(A7)
N$163: R149.2 U7.9(A8)
N$166: R123.1 R124.1 R125.1 R126.2 R127.2 R128.2 R129.2 R130.2 R131.2 R132.2 R133.2
N$167: R144.1 U7.14(Y5)
N$168: R136.1 U7.18(Y1)
N$169: R138.1 U7.17(Y2)
N$170: R140.1 U7.16(Y3)
N$171: R142.1 U7.15(Y4)
N$172: R148.1 U7.13(Y6)
N$173: R150.1 U7.12(Y7)
N$174: R151.1 U7.11(Y8)
N$175: JP18.2 R144.2
N$176: JP18.3 R148.2
N$177: JP19.2 R150.2
N$178: JP19.3 R151.2
N$179: JP16.3 R142.2
N$180: JP16.2 R140.2
N$181: JP15.3 R138.2
N$182: JP15.2 R136.2
N$184: R172.2 U10.2(A1)
N$186: R173.2 U10.3(A2)
N$187: R177.2 U10.5(A4)
N$188: R175.2 U10.4(A3)
N$192: R179.2 U10.6(A5)
N$195: R181.2 U10.7(A6)
N$196: R185.2 U10.8(A7)
N$197: R187.2 U10.9(A8)
N$201: R182.1 U10.14(Y5)
N$202: R174.1 U10.18(Y1)
N$203: R176.1 U10.17(Y2)
N$204: R178.1 U10.16(Y3)
N$205: R180.1 U10.15(Y4)
N$206: R186.1 U10.13(Y6)
N$207: R188.1 U10.12(Y7)
N$208: R189.1 U10.11(Y8)
N$209: JP22.2 R182.2
N$210: JP22.3 R186.2
N$211: JP23.3 R189.2
N$213: JP21.3 R180.2
N$214: JP21.2 R178.2
N$216: JP20.2 R174.2
RG1: R4.3(E) R8.2 U1.P$10(G1)
RG2: R4.2(S) R8.1 U1.P$1(G2)
VBIAS: C24.1 R2.2 R25.2 U1.P$4(BIAS)
VCC: C1.+ C2.+ C3.+ C4.+ C5.P$1 C6.P$1 C7.P$1 C8.P$1 C9.P$1 C10.P$1 C11.P$1 C12.P$1 C13.P$1 C14.P$1 C15.P$1 C16.P$1 C17.P$1 C18.P$1 C19.P$1 C20.P$1 C21.P$1 C22.P$1 C23.1 C29.P$1 C30.1 C31.P$2 C36.1 C37.P$1 C38.P$1 C39.P$1 C43.P$2 C47.P$2 C48.P$2 C49.P$1 C50.1 C51.P$2 C56.P$2 C61.P$2 C62.P$2 C63.P$1 C64.1 C65.P$2 C66.P$2 C67.P$2 C70.P$2 C71.P$1 C72.1 C73.P$2 C74.P$2 C75.P$2 C76.P$2 J1.PWR JP3.4 JP6.4 JP7.4 JP8.4 JP9.4 JP10.4 JP12.4 JP13.4 JP15.4 JP16.4 JP18.4 JP19.4 JP20.4 JP21.4 JP22.4 JP23.4 L1.P$1 R5.1 R32.2 R33.2 R40.2 R44.2 R48.1 R58.2 R79.2 R80.2 R94.2 R97.2 R99.2 R124.2 R145.2 R146.2 R162.2 R183.2 R184.2 U2.20(VCC) U3.2(VIN) U4.20(VCC) U7.20(VCC) U10.20(VCC)
VPP: C40.P$1 C41.P$1 C42.1 D3.C R23.2 R24.2 R41.2 R43.2
Unconnected: J1.GND JP1.GND JP1.GND_2(GND) JP1.REF JP1.TCK JP1.TDI JP1.TDO JP1.TMS JP1.VIN JP1.W2_2V5(A_B_POWER:2V5) JP1.W2_2V5_2(A_B_POWER:2V5) JP1.W2_2V5_3(A_B_POWER:2V5) JP1.W2_2V5_4(A_B_POWER:2V5) JP1.W2_3V3_2(A_B_POWER:3V3) JP1.W2_3V3_3(A_B_POWER:3V3) JP1.W2_3V3_4(A_B_POWER:3V3) JP1.W2_5V(A_B_POWER:5V0) JP1.W2_5V_2(A_B_POWER:5V0) JP1.W2_5V_3(A_B_POWER:5V0) JP1.W2_5V_4(A_B_POWER:5V0) JP1.W3_2V5(C_POWER:2V5) JP1.W3_2V5_2(C_POWER:2V5) JP1.W3_5V_2(C_POWER:5V0) JP5.RSH JP5.TSH JP14.RSH JP14.TSH JP17.1(NC1) JP17.2(NC2) JP17.3(NC3) R4.1(A) U5.3(PIO6) U5.4(PIO7) U5.6(SPICLK) U5.17(USBD+) U5.18(USBD-) U5.20(PIO3) U5.23(SPICSB) U5.24(SPIMISO) U5.26(NC) U5.30(AIO2) U5.31(PIO8) U5.32(PIO9) U5.33(PIO10) U5.34(PIO11) U5.35(AIO1) U8.P$7(VB)

## Notes on the sheet
- Power Regulation | LED Strip Circuits | Audio Input | Papilio Connections
- Balanced Mic Input
- 48V+ Phantom Power
- Bluetooth | SPI ADC
- MIDI Input
- SPI Flash

## Library data of the parts
C1-C4 = adafruit:CPOL-US: POLARIZED CAPACITOR, American symbol
C5-C76 = 1_Dan Master:CAPACITOR: SMT Capacitor
D1-D8 D11 = 1_Dan Master:DIODE_SMD: Diode
D9 D10 = 1_Dan Master:LED: Chip Mount, SMT, LED
J1 = SparkFun-Connectors:POWER_JACK: Power Jack This is the standard 5.5mm barrel jack for power. The PTH is the most common, proven, reliable, footprint. All others are experimental. The Slot footprint only works if the mill layer is transmitted to the PCB fab house so be warned. Spark Fun Electronics SKU : PRT-00119. Mating wall wart : TOL-00298 (and others)
JP1 = 1_Dan Master:PAPILIO_PLUS_MEGAWING
JP2 = SparkFun-Connectors:M02: Header 2 Standard 2-pin 0.1" header. Use with straight break away headers (SKU : PRT-00116), right angle break away headers (PRT-00553), swiss pins (PRT-00743), machine pins (PRT-00117), and female headers (PRT-00115). Molex polarized connector foot print use with SKU : PRT-08233 with associated crimp pins and housings.
JP3 JP6-JP10 JP12 JP13 JP15 JP16 JP18-JP23 = SparkFun-Connectors:M04: Header 4 Standard 4-pin 0.1" header. Use with straight break away headers (SKU : PRT-00116), right angle break away headers (PRT-00553), swiss pins (PRT-00743), machine pins (PRT-00117), and female headers (PRT-00115). Molex polarized connector foot print use with SKU : PRT-08231 with associated crimp pins and housings. 1MM SMD Version SKU: PRT-10208
JP4 = 1_Dan Master:HEADER-SMALL-1PIN
JP5 JP14 = SparkFun-Connectors:AUDIO-JACK2: Stereo audio jack with bypass switches.
JP11 = SparkFun-Connectors:M08: Header 8 Standard 8-pin 0.1" header. Use with straight break away headers (SKU : PRT-00116), right angle break away headers (PRT-00553), swiss pins (PRT-00743), machine pins (PRT-00117), and female headers (PRT-00115).
JP17 = GadgetFactory:MIDI_CONN_FEMALE_SUPPORT
L1 L2 = 1_Dan Master:INDUCTOR: SMT Inductor
LOGO1 = 1_Dan Master:LOGO: BES Square Logo
R1-R3 R5-R191 = 1_Dan Master:RESISTOR: Resistor, Chip Mount, SMT
R4 = adafruit:TRIMPOT: SMT trimmer potentiometer part number TC33X http://www.ladyada.net/library/eagle
SW1 = SparkFun-Electromechanical:SW_DIP-2: DIP SWITCH
U1 = 1_Dan Master:MAX4062
U2 U4 U7 U10 = 1_Dan Master:SN74HCT541
U3 = 1_Dan Master:LM5002
U5 = SparkFun-RF:BLUETOOTH-RN41: Bluetooth SMD module
U6 = 1_Dan Master:ADC128S102
U8 = 1_Dan Master:6N138: MOTOROLA OPTO COUPLER
U9 = GadgetFactory:FLASH-SPI-25XX: SPI Flash